# Altium project Power Board.PrjPcb
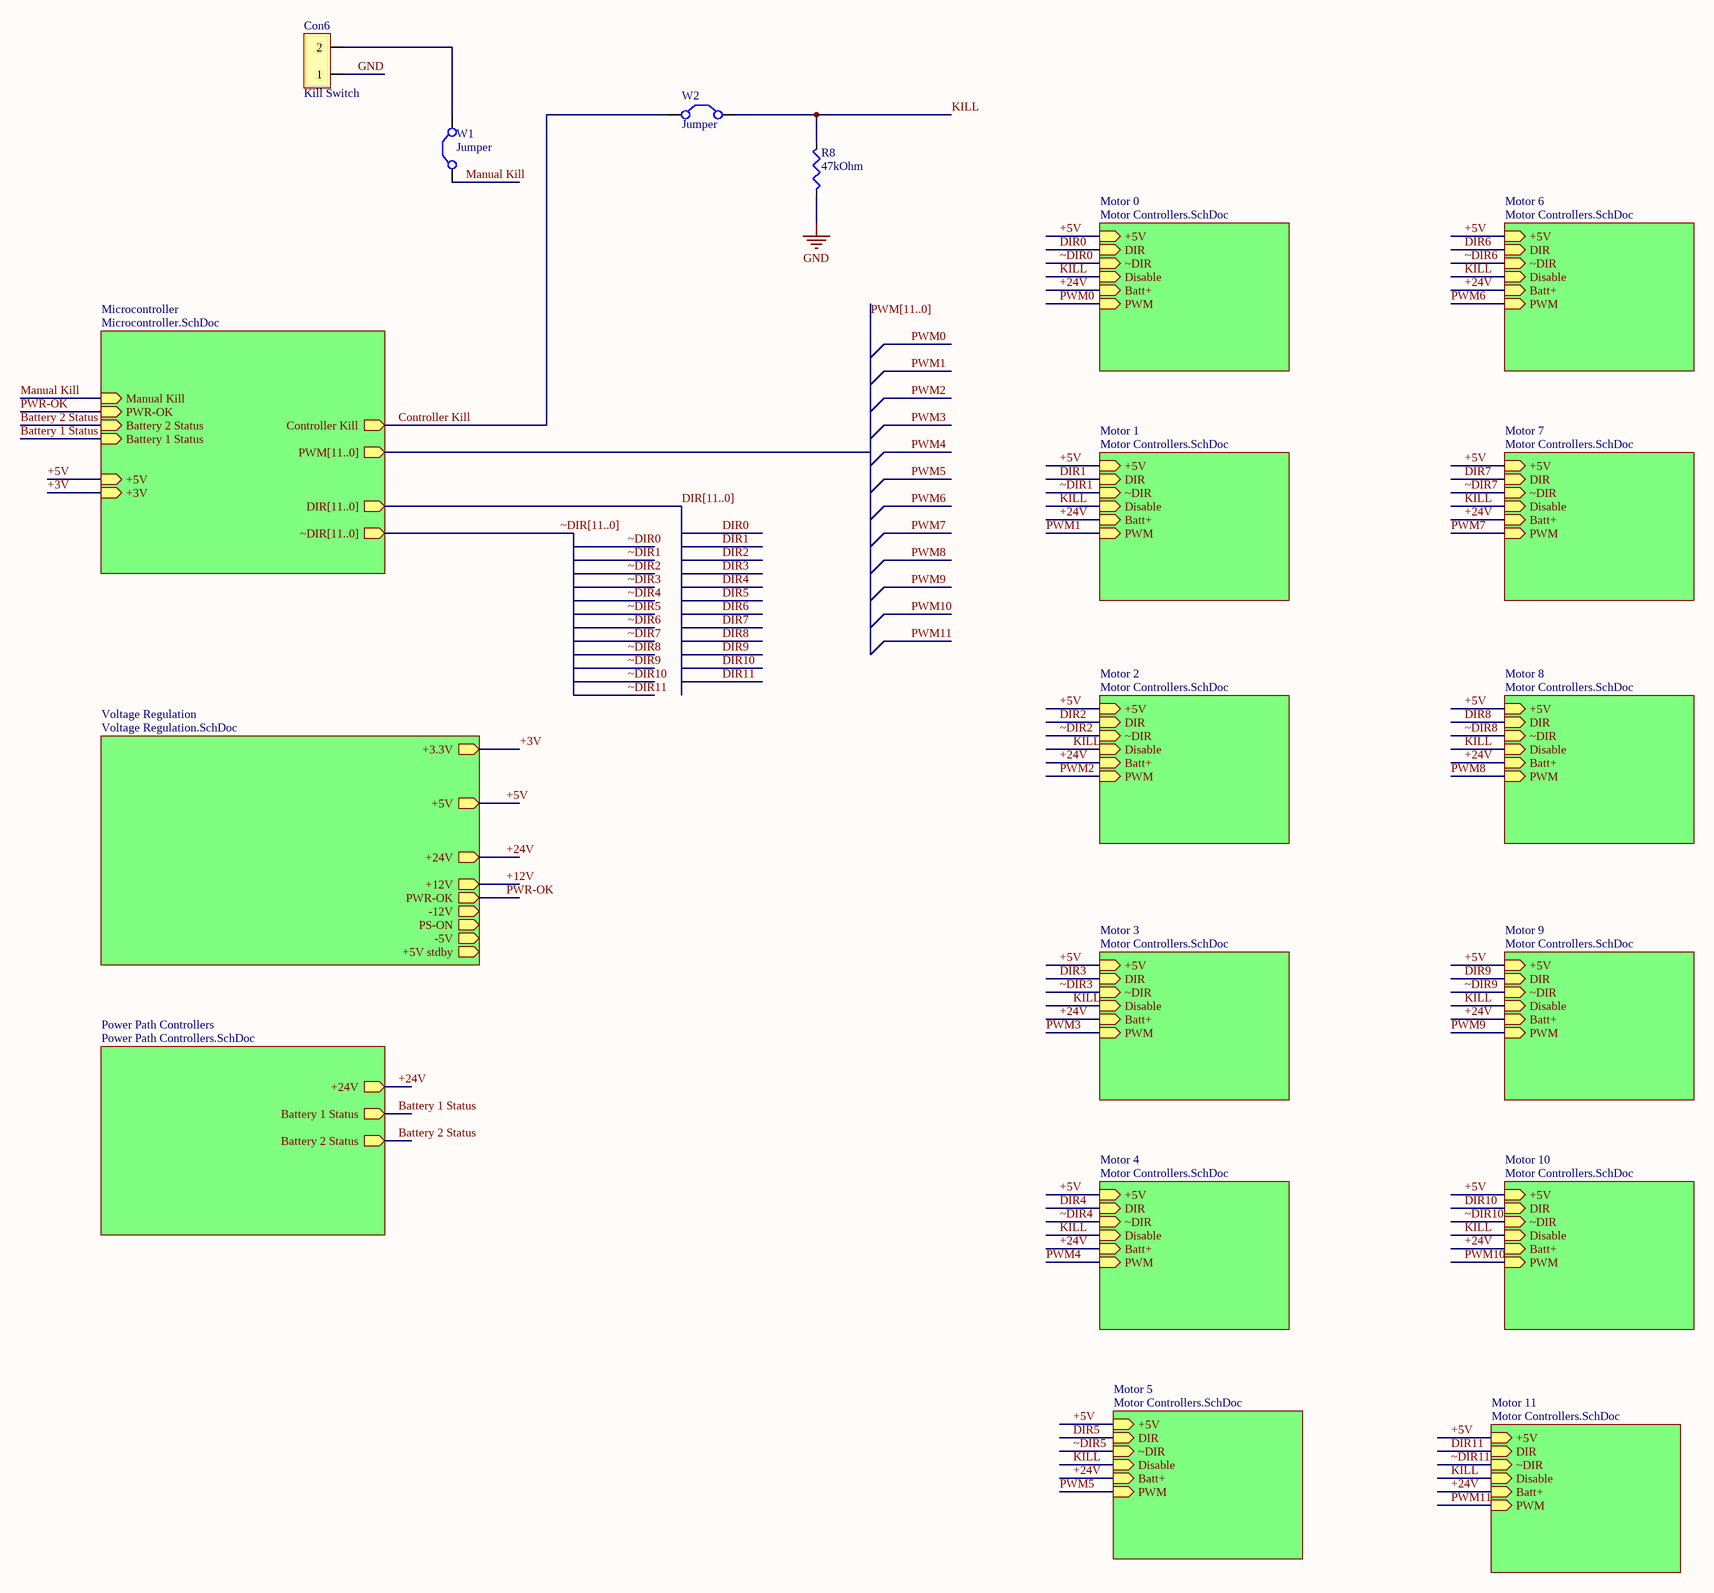
[diagram p0: Top Level Schematic.SchDoc]
3 sheets, 217 parts. Net scope: hierarchical (ports join the sheet entries above them; power ports are global).
Sheets:
  Top Level Schematic.SchDoc
    Microcontroller = Microcontroller.SchDoc
    Motor 0 = Motor Controllers.SchDoc
    Motor 1 = Motor Controllers.SchDoc
    Motor 2 = Motor Controllers.SchDoc
    Motor 3 = Motor Controllers.SchDoc
    Motor 4 = Motor Controllers.SchDoc
    Motor 5 = Motor Controllers.SchDoc
    Motor 6 = Motor Controllers.SchDoc
    Motor 7 = Motor Controllers.SchDoc
    Motor 8 = Motor Controllers.SchDoc
    Motor 9 = Motor Controllers.SchDoc
    Motor 11 = Motor Controllers.SchDoc
    Motor 10 = Motor Controllers.SchDoc

## Sheet Top Level Schematic.SchDoc
size E; DocumentNumber: 1; SheetNumber: 1; SheetTotal: 4

### Parts
Con6  Kill Switch  [5569 Mini-Fit Jr 2-Pos Right Angle w/ PCB Mounting Flange]
R8  47kOhm  [R 1210 (3225) RESISTOR]
W1  Jumper  [RAD-0.2]
W2  Jumper  [RAD-0.2]

### Sub-sheets
Microcontroller = Microcontroller.SchDoc: PWM[11..0] (out), DIR[11..0] (out), +5V (in), ~DIR[11..0] (out), +3V (in), Controller Kill (out), Battery 1 Status (in), Battery 2 Status (in), PWR-OK (in), Manual Kill (in)
Motor 0 = Motor Controllers.SchDoc: DIR (in), ~DIR (in), Disable (in), Batt+ (in), PWM (in), +5V (in)
Motor 1 = Motor Controllers.SchDoc: DIR (in), ~DIR (in), Disable (in), Batt+ (in), PWM (in), +5V (in)
Motor 2 = Motor Controllers.SchDoc: DIR (in), ~DIR (in), Disable (in), Batt+ (in), PWM (in), +5V (in)
Motor 3 = Motor Controllers.SchDoc: DIR (in), ~DIR (in), Disable (in), Batt+ (in), PWM (in), +5V (in)
Motor 4 = Motor Controllers.SchDoc: DIR (in), ~DIR (in), Disable (in), Batt+ (in), PWM (in), +5V (in)
Motor 5 = Motor Controllers.SchDoc: DIR (in), ~DIR (in), Disable (in), Batt+ (in), PWM (in), +5V (in)
Motor 6 = Motor Controllers.SchDoc: DIR (in), ~DIR (in), Disable (in), Batt+ (in), PWM (in), +5V (in)
Motor 7 = Motor Controllers.SchDoc: DIR (in), ~DIR (in), Disable (in), Batt+ (in), PWM (in), +5V (in)
Motor 8 = Motor Controllers.SchDoc: DIR (in), ~DIR (in), Disable (in), Batt+ (in), PWM (in), +5V (in)
Motor 9 = Motor Controllers.SchDoc: DIR (in), ~DIR (in), Disable (in), Batt+ (in), PWM (in), +5V (in)
Motor 10 = Motor Controllers.SchDoc: DIR (in), ~DIR (in), Disable (in), Batt+ (in), PWM (in), +5V (in)
Motor 11 = Motor Controllers.SchDoc: DIR (in), ~DIR (in), Disable (in), Batt+ (in), PWM (in), +5V (in)
Power Path Controllers = Power Path Controllers.SchDoc (file not in this document): +24V (out), Battery 1 Status (out), Battery 2 Status (out)
Voltage Regulation = Voltage Regulation.SchDoc (file not in this document): +3.3V (out), +5V (out), +12V (out), PWR-OK (out), -12V (out), PS-ON (out), -5V (out), +5V stdby (out), +24V (out)

### Nets
GND: Con6.1 R8.1
+3V: sheet Microcontroller/+3V, sheet Voltage Regulation/+3.3V
+5V: sheet Microcontroller/+5V, sheet Motor 0/+5V, sheet Motor 1/+5V, sheet Motor 2/+5V, sheet Motor 3/+5V, sheet Motor 4/+5V, sheet Motor 5/+5V, sheet Motor 6/+5V, sheet Motor 7/+5V, sheet Motor 8/+5V, sheet Motor 9/+5V, sheet Motor 11/+5V, sheet Motor 10/+5V, sheet Voltage Regulation/+5V
+12V: sheet Voltage Regulation/+12V
+24V: sheet Motor 0/Batt+, sheet Motor 1/Batt+, sheet Motor 2/Batt+, sheet Motor 3/Batt+, sheet Motor 4/Batt+, sheet Motor 5/Batt+, sheet Motor 6/Batt+, sheet Motor 7/Batt+, sheet Motor 8/Batt+, sheet Motor 9/Batt+, sheet Motor 11/Batt+, sheet Motor 10/Batt+, sheet Voltage Regulation/+24V, sheet Power Path Controllers/+24V
Battery 1 Status: sheet Microcontroller/Battery 1 Status, sheet Power Path Controllers/Battery 1 Status
Battery 2 Status: sheet Microcontroller/Battery 2 Status, sheet Power Path Controllers/Battery 2 Status
Controller Kill: W2.1(C1) ; sheet Microcontroller/Controller Kill
KILL: R8.2 W2.2(C2) ; sheet Motor 0/Disable, sheet Motor 1/Disable, sheet Motor 2/Disable, sheet Motor 3/Disable, sheet Motor 4/Disable, sheet Motor 5/Disable, sheet Motor 6/Disable, sheet Motor 7/Disable, sheet Motor 8/Disable, sheet Motor 9/Disable, sheet Motor 11/Disable, sheet Motor 10/Disable  [project net Disable]
Manual Kill: W1.1(C1) ; sheet Microcontroller/Manual Kill
PWR-OK: sheet Microcontroller/PWR-OK, sheet Voltage Regulation/PWR-OK
NetCon6_2: Con6.2 W1.2(C2)

### Buses and harness runs
bus DIR[11..0] = sheet Microcontroller/DIR[11..0]
bus PWM[11..0] = sheet Microcontroller/PWM[11..0]
bus ~DIR[11..0] = sheet Microcontroller/~DIR[11..0]

### Library data of the parts
Con6 = 5569 Mini-Fit Jr 2-Pos Right Angle
R8 = Resistor: Value: 0Ohm
W1 W2 = Jumper: Jumper Wire; Published: 24-Mar-1999; LatestRevisionDate: 17-Jul-2002; LatestRevisionNote: Re-released for DXP Platform.; PackageReference: RAD-0.2; Publisher: Altium Limited

## Sheet Microcontroller.SchDoc
size E; DocumentNumber: 2; SheetNumber: 2; SheetTotal: 4
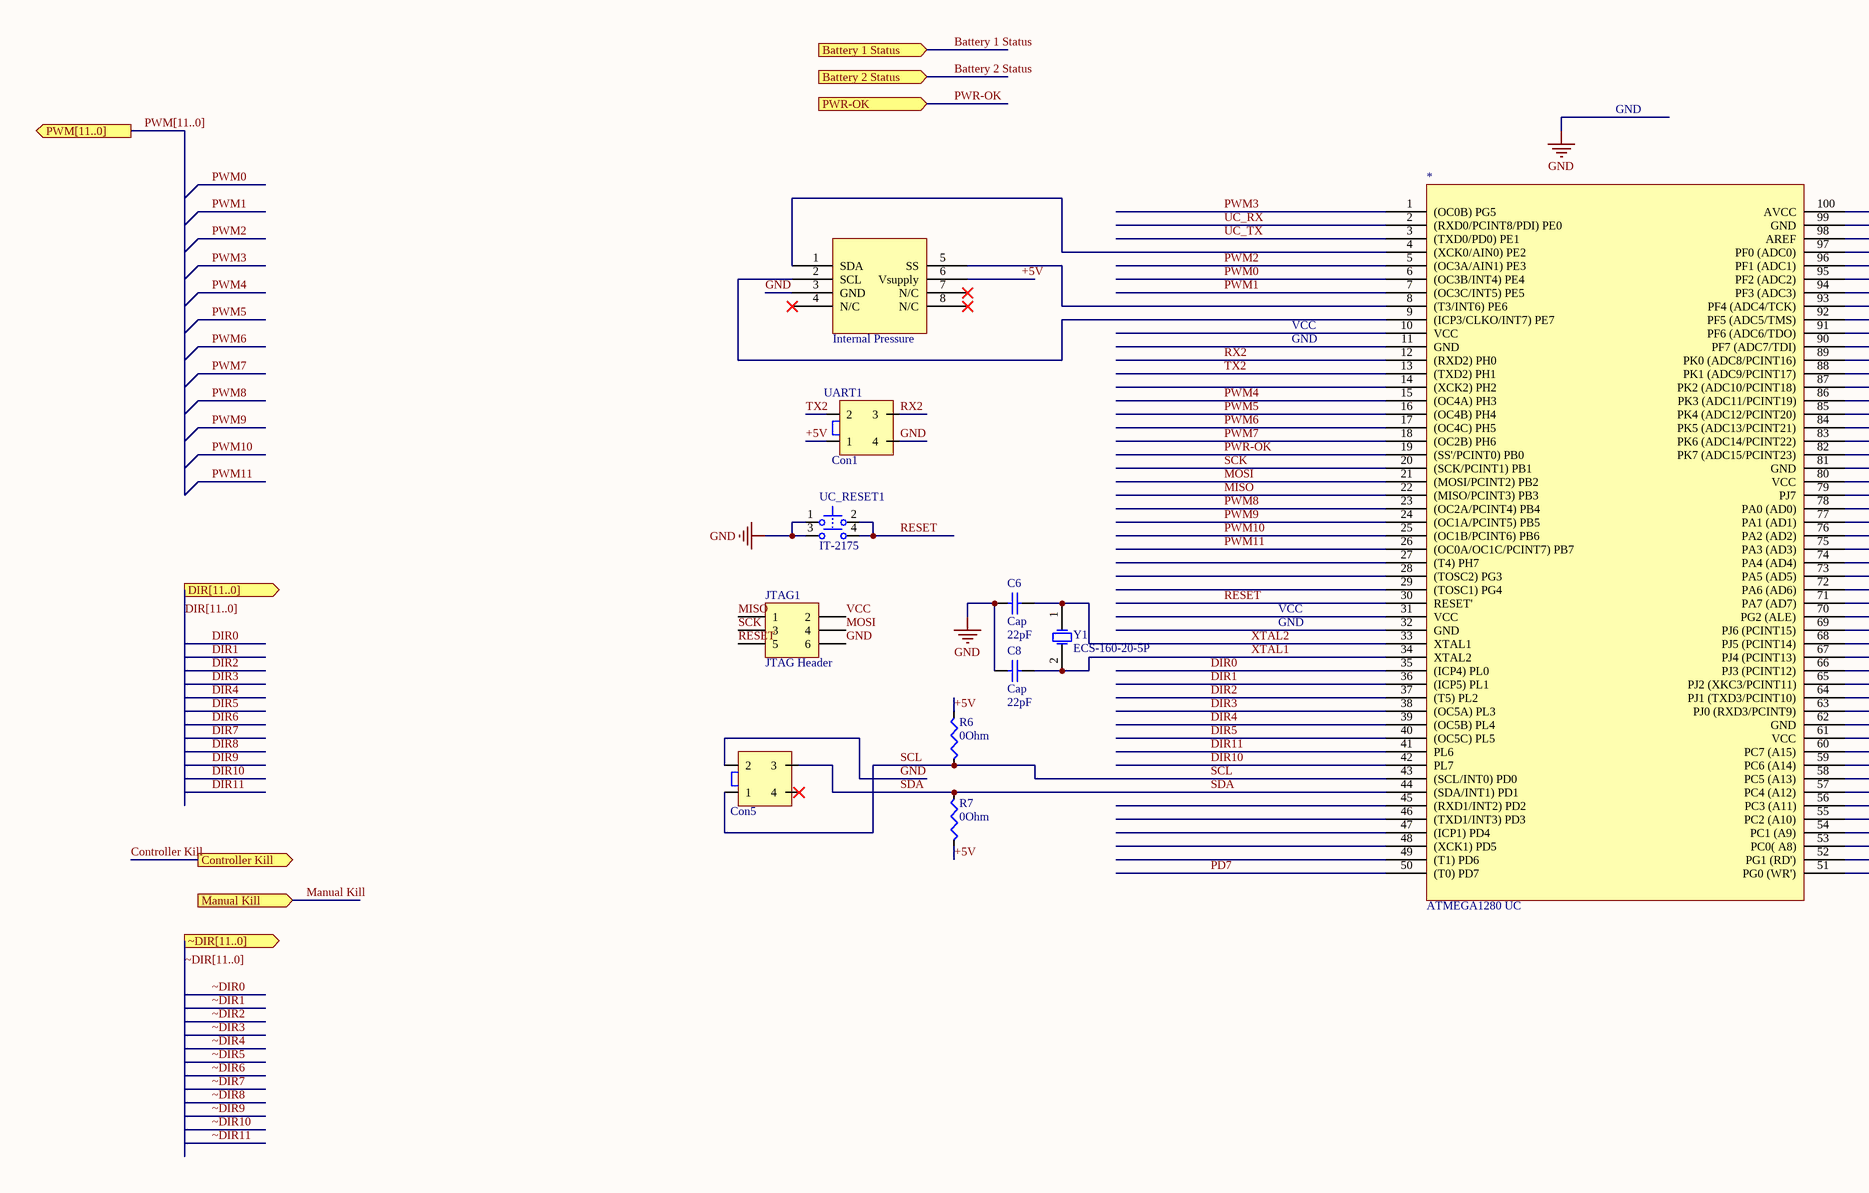
[diagram p1: Microcontroller.SchDoc, left]
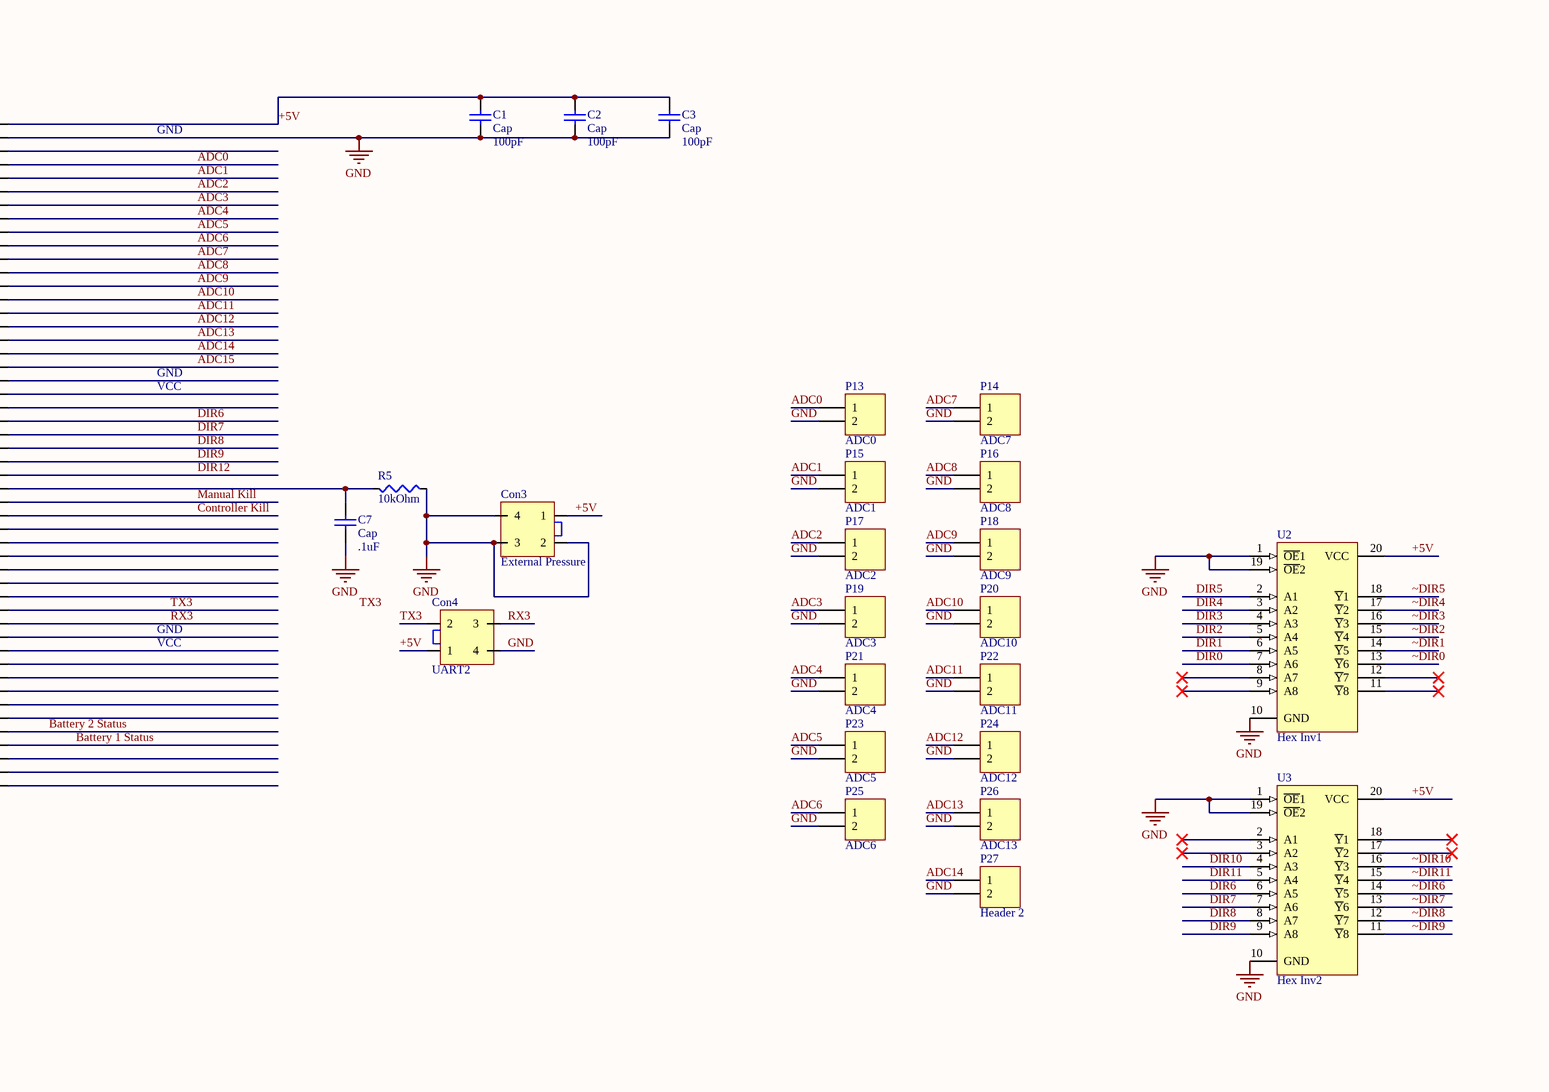
[diagram p2: Microcontroller.SchDoc, middle]
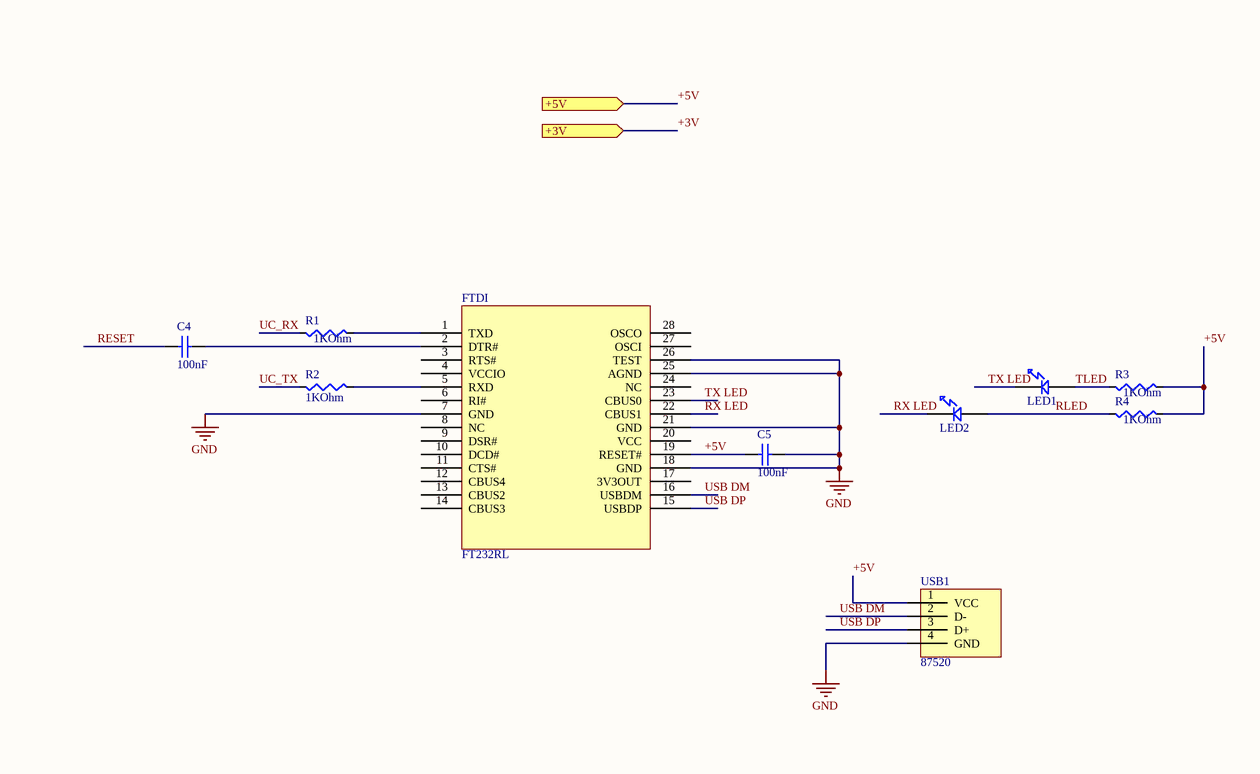
[diagram p3: Microcontroller.SchDoc, right]

### Parts
*  ATMEGA1280 UC  [TSQFP50P1600X1600X120-100N]
?  Internal Pressure  [SOP254P1740X1413-8N]
C1  Cap  value 100pF  [0805 (2012) Capacitor]
C2  Cap  value 100pF  [0805 (2012) Capacitor]
C3  Cap  value 100pF  [0805 (2012) Capacitor]
C4  100nF  [0805 (2012) Capacitor]
C5  100nF  [0805 (2012) Capacitor]
C6  Cap  value 22pF  [0805 (2012) Capacitor]
C7  Cap  value .1uF  [0805 (2012) Capacitor]
C8  Cap  value 22pF  [0805 (2012) Capacitor]
Con1  UART1  [5566-4]
Con3  External Pressure  [5566-4]
Con4  UART2  [5566-4]
Con5  5566-4  [5566-4]  (value not drawn)
FTDI  FT232RL  [SOP65P780X200-28N]
JTAG1  JTAG Header  [HDR2X3]
LED1  LED  [LED 0805]  (value not drawn)
LED2  LED  [LED 0805]  (value not drawn)
P13  ADC0  [HDR1X2]
P14  ADC7  [HDR1X2]
P15  ADC1  [HDR1X2]
P16  ADC8  [HDR1X2]
P17  ADC2  [HDR1X2]
P18  ADC9  [HDR1X2]
P19  ADC3  [HDR1X2]
P20  ADC10  [HDR1X2]
P21  ADC4  [HDR1X2]
P22  ADC11  [HDR1X2]
P23  ADC5  [HDR1X2]
P24  ADC12  [HDR1X2]
P25  ADC6  [HDR1X2]
P26  ADC13  [HDR1X2]
P27  Header 2  [HDR1X2]
R1  1KOhm  [R 0805 (2012) RESISTOR]
R2  1KOhm  [R 0805 (2012) RESISTOR]
R3  1KOhm  [R 0805 (2012) RESISTOR]
R4  1KOhm  [R 0805 (2012) RESISTOR]
R5  10kOhm  [R 0805 (2012) RESISTOR]
R6  0Ohm  [R 1210 (3225) RESISTOR]
R7  0Ohm  [R 1210 (3225) RESISTOR]
U2  Hex Inv1  [DW020_N]
U3  Hex Inv2  [DW020_N]
UC_RESET1  IT-2175  [IT-2175]
USB1  87520  [87520-0010BLF]
Y1  ECS-160-20-5P  [CSM-7]

### Ports
+3V (in), +5V (in), Battery 1 Status (in), Battery 2 Status (in), Controller Kill (out), DIR[11..0] (out), Manual Kill (in), PWM[11..0] (out), PWR-OK (in), ~DIR[11..0] (out)

### Nets
GND: *.11(GND) *.32(GND) *.62(GND) *.81(GND) *.99(GND) ?.3(GND) C1.1 C2.1 C3.1 C5.2 C6.1 C7.2 C8.1 Con1.4 Con3.2 Con3.3 Con3.4 Con4.4 Con5.2 FTDI.7(GND) FTDI.18(GND) FTDI.21(GND) FTDI.25(AGND) FTDI.26(TEST) JTAG1.6 P13.2 P14.2 P15.2 P16.2 P17.2 P18.2 P19.2 P20.2 P21.2 P22.2 P23.2 P24.2 P25.2 P26.2 P27.2 R5.2 U2.1(~{OE}1) U2.10(GND) U2.19(~{OE}2) U3.1(~{OE}1) U3.10(GND) U3.19(~{OE}2) UC_RESET1.1 UC_RESET1.3 USB1.4(GND)
+3V: port +3V
+5V: *.100(AVCC) ?.6(Vsupply) C1.2 C2.2 C3.2 C5.1 Con1.1 Con3.1 Con4.1 FTDI.19(RESET#) R3.2 R4.2 R6.2 R7.1 U2.20(VCC) U3.20(VCC) USB1.1(VCC) ; port +5V
ADC0: *.97(PF0_(ADC0)) P13.1
ADC1: *.96(PF1_(ADC1)) P15.1
ADC2: *.95(PF2_(ADC2)) P17.1
ADC3: *.94(PF3_(ADC3)) P19.1
ADC4: *.93(PF4_(ADC4/TCK)) P21.1
ADC5: *.92(PF5_(ADC5/TMS)) P23.1
ADC6: *.91(PF6_(ADC6/TDO)) P25.1
ADC7: *.90(PF7_(ADC7/TDI)) P14.1
ADC8: *.89(PK0_(ADC8/PCINT16)) P16.1
ADC9: *.88(PK1_(ADC9/PCINT17)) P18.1
ADC10: *.87(PK2_(ADC10/PCINT18)) P20.1
ADC11: *.86(PK3_(ADC11/PCINT19)) P22.1
ADC12: *.85(PK4_(ADC12/PCINT20)) P24.1
ADC13: *.84(PK5_(ADC13/PCINT21)) P26.1
ADC14: *.83(PK6_(ADC14/PCINT22)) P27.1
ADC15: *.82(PK7_(ADC15/PCINT23))
Battery 1 Status: *.54(PC1_(A9)) ; port Battery 1 Status
Battery 2 Status: *.55(PC2_(A10)) ; port Battery 2 Status
Controller Kill: *.71(PA7_(AD7)) ; port Controller Kill
DIR0: *.35((ICP4)_PL0) U2.7(A6)  [project net DIR]
DIR1: *.36((ICP5)_PL1) U2.6(A5)  [project net DIR]
DIR2: *.37((T5)_PL2) U2.5(A4)  [project net DIR]
DIR3: *.38((OC5A)_PL3) U2.4(A3)  [project net DIR]
DIR4: *.39((OC5B)_PL4) U2.3(A2)  [project net DIR]
DIR5: *.40((OC5C)_PL5) U2.2(A1)  [project net DIR]
DIR6: *.78(PA0_(AD0)) U3.6(A5)  [project net DIR]
DIR7: *.77(PA1_(AD1)) U3.7(A6)  [project net DIR]
DIR8: *.76(PA2_(AD2)) U3.8(A7)  [project net DIR]
DIR9: *.75(PA3_(AD3)) U3.9(A8)  [project net DIR]
DIR10: *.42(PL7) U3.4(A3)  [project net DIR]
DIR11: *.41(PL6) U3.5(A4)  [project net DIR]
DIR12: *.74(PA4_(AD4))
Manual Kill: *.72(PA6_(AD6)) ; port Manual Kill
MISO: *.22((MISO/PCINT3)_PB3) JTAG1.1
MOSI: *.21((MOSI/PCINT2)_PB2) JTAG1.4
PD7: *.50((T0)_PD7)
PWM0: *.6((OC3B/INT4)_PE4)  [project net PWM]
PWM1: *.7((OC3C/INT5)_PE5)  [project net PWM]
PWM2: *.5((OC3A/AIN1)_PE3)  [project net PWM]
PWM3: *.1((OC0B)_PG5)  [project net PWM]
PWM4: *.15((OC4A)_PH3)  [project net PWM]
PWM5: *.16((OC4B)_PH4)  [project net PWM]
PWM6: *.17((OC4C)_PH5)  [project net PWM]
PWM7: *.18((OC2B)_PH6)  [project net PWM]
PWM8: *.23((OC2A/PCINT4)_PB4)  [project net PWM]
PWM9: *.24((OC1A/PCINT5)_PB5)  [project net PWM]
PWM10: *.25((OC1B/PCINT6)_PB6)  [project net PWM]
PWM11: *.26((OC0A/OC1C/PCINT7)_PB7)  [project net PWM]
PWR-OK: *.19((SS'/PCINT0)_PB0) ; port PWR-OK
RESET: *.30(RESET') C4.1 JTAG1.5 UC_RESET1.2 UC_RESET1.4
RLED: LED2.2 R4.1
RX2: *.12((RXD2)_PH0) Con1.3
RX3: *.63(PJ0_(RXD3/PCINT9)) Con4.3
RX LED: FTDI.22(CBUS1) LED2.1
SCK: *.20((SCK/PCINT1)_PB1) JTAG1.3
SCL: *.43((SCL/INT0)_PD0) Con5.1 R6.1
SDA: *.44((SDA/INT1)_PD1) Con5.3 R7.2
TLED: LED1.2 R3.1
TX2: *.13((TXD2)_PH1) Con1.2
TX3: *.64(PJ1_(TXD3/PCINT10)) Con4.2
TX LED: FTDI.23(CBUS0) LED1.1
UC_RX: *.2((RXD0/PCINT8/PDI)_PE0) R1.1
UC_TX: *.3((TXD0/PD0)_PE1) R2.1
USB DM: FTDI.16(USBDM) USB1.2(D-)
USB DP: FTDI.15(USBDP) USB1.3(D+)
VCC: *.10(VCC) *.31(VCC) *.61(VCC) *.80(VCC) JTAG1.2
XTAL1: *.34(XTAL2) C8.2 Y1.2(OSC2)
XTAL2: *.33(XTAL1) C6.2 Y1.1(OSC1)
~DIR0: U2.13(~{Y}6)  [project net ~DIR]
~DIR1: U2.14(~{Y}5)  [project net ~DIR]
~DIR2: U2.15(~{Y}4)  [project net ~DIR]
~DIR3: U2.16(~{Y}3)  [project net ~DIR]
~DIR4: U2.17(~{Y}2)  [project net ~DIR]
~DIR5: U2.18(~{Y}1)  [project net ~DIR]
~DIR6: U3.14(~{Y}5)  [project net ~DIR]
~DIR7: U3.13(~{Y}6)  [project net ~DIR]
~DIR8: U3.12(~{Y}7)  [project net ~DIR]
~DIR9: U3.11(~{Y}8)  [project net ~DIR]
~DIR10: U3.16(~{Y}3)  [project net ~DIR]
~DIR11: U3.15(~{Y}4)  [project net ~DIR]
Net*_4: *.4((XCK0/AIN0)_PE2) ?.1(SDA)
Net*_8: *.8((T3/INT6)_PE6) ?.5(SS)
Net*_9: *.9((ICP3/CLKO/INT7)_PE7) ?.2(SCL)
Net*_73: *.73(PA5_(AD5)) C7.1 R5.1
NetC4_2: C4.2 FTDI.2(DTR#)
NetFTDI_1: FTDI.1(TXD) R1.2
NetFTDI_5: FTDI.5(RXD) R2.2

Not connected (* = marked no-connect by the designer): * 14((XCK2)_PH2) 27((T4)_PH7) 28((TOSC2)_PG3) 29((TOSC1)_PG4) 45((RXD1/INT2)_PD2) 46((TXD1/INT3)_PD3) 47((ICP1)_PD4) 48((XCK1)_PD5) 49((T1)_PD6) 51(PG0_(WR')) 52(PG1_(RD')) 53(PC0(_A8)) 56(PC3_(A11)) 57(PC4_(A12)) 58(PC5_(A13)) 59(PC6_(A14)) 60(PC7_(A15)) 65(PJ2_(XKC3/PCINT11)) 66(PJ3_(PCINT12)) 67(PJ4_(PCINT13)) 68(PJ5_(PCINT14)) 69(PJ6_(PCINT15)) 70(PG2_(ALE)) 79(PJ7) 98(AREF); ? 4(N/C)* 7(N/C)* 8(N/C)*; Con5 4*; FTDI 3(RTS#) 4(VCCIO) 6(RI#) 8(NC) 9(DSR#) 10(DCD#) 11(CTS#) 12(CBUS4) 13(CBUS2) 14(CBUS3) 17(3V3OUT) 20(VCC) 24(NC) 27(OSCI) 28(OSCO); U2 8(A7)* 9(A8)* 11(~{Y}8)* 12(~{Y}7)*; U3 2(A1)* 3(A2)* 17(~{Y}2)* 18(~{Y}1)*

### Buses and harness runs
bus DIR[11..0] = port DIR[11..0]
bus PWM[11..0] = port PWM[11..0]
bus ~DIR[11..0] = port ~DIR[11..0]

### Notes on the sheet
- Labels drawn without touching a wire or pin: TX3

### Library data of the parts
* ? FTDI = Component_1
C1-C3 C6-C8 = Cap: Capacitor; Published: 8-Jun-2000; LatestRevisionDate: 17-Jul-2002; LatestRevisionNote: Re-released for DXP Platform.; PackageReference: RAD-0.3; Publisher: Altium Limited
C4 C5 = Capacitor (non-polarized): Capacitor; Value: .1uF
Con1 Con3-Con5 = 5566-4: 4.20mm (.165") Pitch Mini-Fit Jr.™ Header, Dual Row, Vertical, without Snap-in Plastic Peg PCB Lock, 4 Circuits, PA Polyamide Nylon 6/6 94V-2, Tin (Sn) Plating, without Drain Holes
JTAG1 = Header 3X2: Header, 3-Pin, Dual row; LatestRevisionDate: 17-Jul-2002; LatestRevisionNote: Re-released for DXP Platform.; Publisher: Altium Limited
LED1 LED2 = LED: Standard LED
P13-P27 = Header 2: Header, 2-Pin; LatestRevisionDate: 17-Jul-2002; LatestRevisionNote: Re-released for DXP Platform.; Publisher: Altium Limited
R1-R5 = Resistor: Value: 0Ohm
R6 R7 = Resistor: Value: 0Ohm
U2 U3 = SN74HCT540DW: Octal Buffer and Line Driver with 3-State Outputs; Published: 8-Jun-2000; LatestRevisionDate: 13-Apr-2006; LatestRevisionNote: IPC-7351 Footprint Added.; DatasheetVersion: May-1997; PackageVersion: Mar-2000; PackageReference: DW020; Publisher: Altium Limited; PackageDescription: 20-Pin Plastic Small Outline Integrated Circuit 1.27 mm Pitch; Code_JEDEC: MS-013; Code_IPC: SOIC127P1030-20; ComponentLink1Description: Manufacturer Link; ComponentLink1URL: http://www.ti.com/; ComponentLink2Description: Datasheet; ComponentLink2URL: http://www-s.ti.com/sc/ds/sn74hct540.pdf
UC_RESET1 = IT-2175: Tactile Switch, DPST; Thru-Hole; Vertical; Rating DC 12V, 50mA (max); PackageDocument: Rev.0; Published: 6-Jun-2005; DatasheetDocument: Rev.0; PackageReference: IT-2175; Publisher: Altium Limited; ComponentLink1Description: Manufacturer Link; ComponentLink1URL: http://www.ilswitch.com/; ComponentLink2Description: Device Overview; ComponentLink2URL: http://www.ilswitch.com/list.php?ac_id=010112&ai_id=91
USB1 = 87520: 87520 USB Through Hole Type A Right Angle Receptacle
Y1 = ECS-120-32-1: Crystal Oscillator; Published: 17-Jul-2002; DatasheetDocument: 18-Apr-2000; PackageReference: HC-49U; Publisher: Altium Limited; ComponentLink1Description: Manufacturer Link; ComponentLink1URL: http://www.ecsxtal.com/; ComponentLink2Description: Datasheet; ComponentLink2URL: http://www.ecsxtal.com/pdf2/HC49U.PDF

## Sheet Motor Controllers.SchDoc
size B; DocumentNumber: 3; SheetNumber: 3; SheetTotal: 4
Used 12 times, as channels Motor 0, Motor 1, Motor 2, Motor 3, Motor 4, Motor 5, Motor 6, Motor 7, Motor 8, Motor 9, Motor 11, Motor 10. Parts and nets are listed once, with the designators drawn on the sheet.
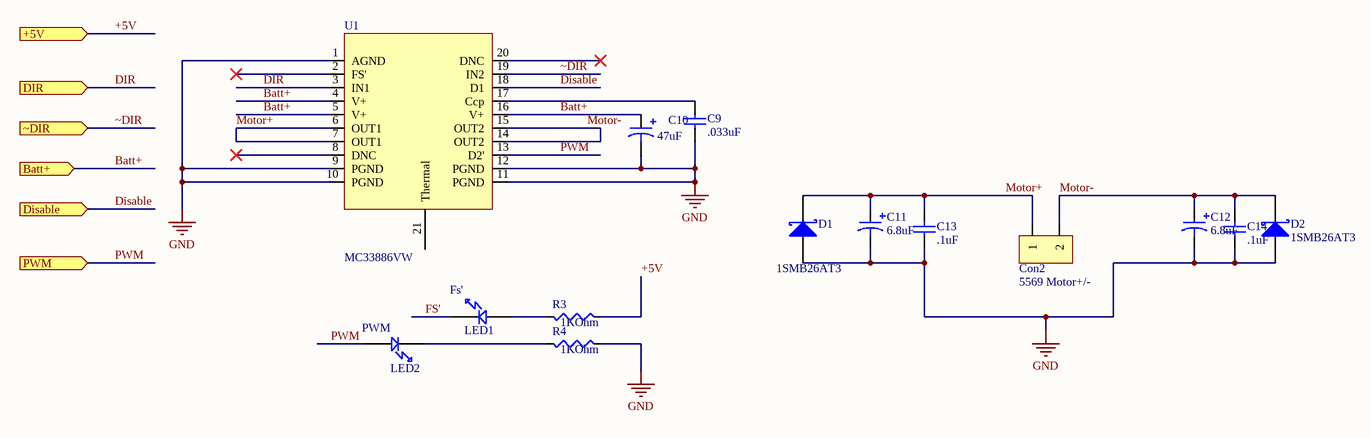
[diagram p4: Motor Controllers.SchDoc]

### Parts
C9  .033uF  [0805 (2012) Capacitor]
C10  47uF  [Radial_6.3mmDia_SM_D]
C11  6.8uF  [Radial_8mmDia_SM_E]
C12  6.8uF  [Radial_8mmDia_SM_E]
C13  .1uF  [0805 (2012) Capacitor]
C14  .1uF  [0805 (2012) Capacitor]
Con2  5569 Motor+/-  [5569 Mini-Fit Jr 2-Pos Right Angle w/ PCB Mounting Flange]
D1  1SMB26AT3  [SMB]
D2  1SMB26AT3  [SMB]
LED1  Fs'  [LED 0805]
LED2  PWM  [LED 0805]
R3  1KOhm  [R 0805 (2012) RESISTOR]
R4  1KOhm  [R 0805 (2012) RESISTOR]
U1  MC33886VW  [SOP127P1420X340_HS-20N]

### Ports
+5V (in), Batt+ (in), DIR (in), Disable (in), PWM (in), ~DIR (in)

### Nets
GND: C9.1 C10.N C11.N C12.N C13.1 C14.1 D1.1(A) D2.1(A) R4.2 U1.1(AGND) U1.9(PGND) U1.10(PGND) U1.11(PGND) U1.12(PGND)
+5V: R3.2 ; port +5V
Batt+: C10.P U1.4(V+) U1.5(V+) U1.16(V+) ; port Batt+
DIR: U1.3(IN1) ; port DIR
Disable: U1.18(D1) ; port Disable
FS': LED1.1
Motor+: C11.P C13.2 Con2.1 D1.2(K) U1.6(OUT1) U1.7(OUT1)
Motor-: C12.P C14.2 Con2.2 D2.2(K) U1.14(OUT2) U1.15(OUT2)
PWM: LED2.2 U1.13(D2') ; port PWM
~DIR: U1.19(IN2) ; port ~DIR
NetC9_2: C9.2 U1.17(Ccp)
NetLED1_2: LED1.2 R3.1
NetLED2_1: LED2.1 R4.1

Not connected (* = marked no-connect by the designer): U1 2(FS')* 8(DNC)* 20(DNC)* 21(Thermal)

### Channels
Motor 0: designators end in _Motor_0; ports +5V=+5V Batt+=+24V DIR=DIR Disable=Disable PWM=PWM ~DIR=~DIR
Motor 1: designators end in _Motor_1; ports +5V=+5V Batt+=+24V DIR=DIR Disable=Disable PWM=PWM ~DIR=~DIR
Motor 2: designators end in _Motor_2; ports +5V=+5V Batt+=+24V DIR=DIR Disable=Disable PWM=PWM ~DIR=~DIR
Motor 3: designators end in _Motor_3; ports +5V=+5V Batt+=+24V DIR=DIR Disable=Disable PWM=PWM ~DIR=~DIR
Motor 4: designators end in _Motor_4; ports +5V=+5V Batt+=+24V DIR=DIR Disable=Disable PWM=PWM ~DIR=~DIR
Motor 5: designators end in _Motor_5; ports +5V=+5V Batt+=+24V DIR=DIR Disable=Disable PWM=PWM ~DIR=~DIR
Motor 6: designators end in _Motor_6; ports +5V=+5V Batt+=+24V DIR=DIR Disable=Disable PWM=PWM ~DIR=~DIR
Motor 7: designators end in _Motor_7; ports +5V=+5V Batt+=+24V DIR=DIR Disable=Disable PWM=PWM ~DIR=~DIR
Motor 8: designators end in _Motor_8; ports +5V=+5V Batt+=+24V DIR=DIR Disable=Disable PWM=PWM ~DIR=~DIR
Motor 9: designators end in _Motor_9; ports +5V=+5V Batt+=+24V DIR=DIR Disable=Disable PWM=PWM ~DIR=~DIR
Motor 11: designators end in _Motor_11; ports +5V=+5V Batt+=+24V DIR=DIR Disable=Disable PWM=PWM ~DIR=~DIR
Motor 10: designators end in _Motor_10; ports +5V=+5V Batt+=+24V DIR=DIR Disable=Disable PWM=PWM ~DIR=~DIR

### Library data of the parts
C9 = Capacitor (non-polarized): Capacitor; Value: .1uF
C10-C12 = Capacitor (polarized)
C13 C14 = Capacitor (non-polarized): Capacitor; Value: .1uF
Con2 = 5569 Mini-Fit Jr 2-Pos Right Angle
D1 D2 = D Schottky: Schottky Diode; Published: 8-Jun-2000; LatestRevisionDate: 17-Jul-2002; LatestRevisionNote: Re-released for DXP Platform.; PackageReference: SMB; Publisher: Altium Limited; Code_JEDEC: DO-214-AA
LED1 LED2 = LED: Standard LED
R3 R4 = Resistor: Value: 0Ohm
U1 = MC33886VW: Motor Controller

## Nets that join several sheets
GND: Top Level Schematic (Con6.1 R8.1), Microcontroller (50 pins), Motor 0 (14 pins), Motor 1 (14 pins), Motor 2 (14 pins), Motor 3 (14 pins), Motor 4 (14 pins), Motor 5 (14 pins), Motor 6 (14 pins), Motor 7 (14 pins), Motor 8 (14 pins), Motor 9 (14 pins), Motor 11 (14 pins), Motor 10 (14 pins)
+5V: Microcontroller (17 pins), Motor 0 (R3_Motor_0.2), Motor 1 (R3_Motor_1.2), Motor 2 (R3_Motor_2.2), Motor 3 (R3_Motor_3.2), Motor 4 (R3_Motor_4.2), Motor 5 (R3_Motor_5.2), Motor 6 (R3_Motor_6.2), Motor 7 (R3_Motor_7.2), Motor 8 (R3_Motor_8.2), Motor 9 (R3_Motor_9.2), Motor 11 (R3_Motor_11.2), Motor 10 (R3_Motor_10.2)
+24V: Motor 0 (C10_Motor_0.P U1_Motor_0.4 U1_Motor_0.5 U1_Motor_0.16), Motor 1 (C10_Motor_1.P U1_Motor_1.4 U1_Motor_1.5 U1_Motor_1.16), Motor 2 (C10_Motor_2.P U1_Motor_2.4 U1_Motor_2.5 U1_Motor_2.16), Motor 3 (C10_Motor_3.P U1_Motor_3.4 U1_Motor_3.5 U1_Motor_3.16), Motor 4 (C10_Motor_4.P U1_Motor_4.4 U1_Motor_4.5 U1_Motor_4.16), Motor 5 (C10_Motor_5.P U1_Motor_5.4 U1_Motor_5.5 U1_Motor_5.16), Motor 6 (C10_Motor_6.P U1_Motor_6.4 U1_Motor_6.5 U1_Motor_6.16), Motor 7 (C10_Motor_7.P U1_Motor_7.4 U1_Motor_7.5 U1_Motor_7.16), Motor 8 (C10_Motor_8.P U1_Motor_8.4 U1_Motor_8.5 U1_Motor_8.16), Motor 9 (C10_Motor_9.P U1_Motor_9.4 U1_Motor_9.5 U1_Motor_9.16), Motor 11 (C10_Motor_11.P U1_Motor_11.4 U1_Motor_11.5 U1_Motor_11.16), Motor 10 (C10_Motor_10.P U1_Motor_10.4 U1_Motor_10.5 U1_Motor_10.16)
Controller Kill: Top Level Schematic (W2.1), Microcontroller (*.71)
DIR: Microcontroller (*.40 U2.2), Motor 5 (U1_Motor_5.3)
DIR: Microcontroller (*.39 U2.3), Motor 4 (U1_Motor_4.3)
DIR: Microcontroller (*.38 U2.4), Motor 3 (U1_Motor_3.3)
DIR: Microcontroller (*.37 U2.5), Motor 2 (U1_Motor_2.3)
DIR: Microcontroller (*.36 U2.6), Motor 1 (U1_Motor_1.3)
DIR: Microcontroller (*.35 U2.7), Motor 0 (U1_Motor_0.3)
DIR: Microcontroller (*.42 U3.4), Motor 10 (U1_Motor_10.3)
DIR: Microcontroller (*.41 U3.5), Motor 11 (U1_Motor_11.3)
DIR: Microcontroller (*.78 U3.6), Motor 6 (U1_Motor_6.3)
DIR: Microcontroller (*.77 U3.7), Motor 7 (U1_Motor_7.3)
DIR: Microcontroller (*.76 U3.8), Motor 8 (U1_Motor_8.3)
DIR: Microcontroller (*.75 U3.9), Motor 9 (U1_Motor_9.3)
Disable: Top Level Schematic (R8.2 W2.2), Motor 0 (U1_Motor_0.18), Motor 1 (U1_Motor_1.18), Motor 2 (U1_Motor_2.18), Motor 3 (U1_Motor_3.18), Motor 4 (U1_Motor_4.18), Motor 5 (U1_Motor_5.18), Motor 6 (U1_Motor_6.18), Motor 7 (U1_Motor_7.18), Motor 8 (U1_Motor_8.18), Motor 9 (U1_Motor_9.18), Motor 11 (U1_Motor_11.18), Motor 10 (U1_Motor_10.18)
Manual Kill: Top Level Schematic (W1.1), Microcontroller (*.72)
PWM: Microcontroller (*.1), Motor 3 (LED2_Motor_3.2 U1_Motor_3.13)
PWM: Microcontroller (*.5), Motor 2 (LED2_Motor_2.2 U1_Motor_2.13)
PWM: Microcontroller (*.6), Motor 0 (LED2_Motor_0.2 U1_Motor_0.13)
PWM: Microcontroller (*.7), Motor 1 (LED2_Motor_1.2 U1_Motor_1.13)
PWM: Microcontroller (*.15), Motor 4 (LED2_Motor_4.2 U1_Motor_4.13)
PWM: Microcontroller (*.16), Motor 5 (LED2_Motor_5.2 U1_Motor_5.13)
PWM: Microcontroller (*.17), Motor 6 (LED2_Motor_6.2 U1_Motor_6.13)
PWM: Microcontroller (*.18), Motor 7 (LED2_Motor_7.2 U1_Motor_7.13)
PWM: Microcontroller (*.23), Motor 8 (LED2_Motor_8.2 U1_Motor_8.13)
PWM: Microcontroller (*.24), Motor 9 (LED2_Motor_9.2 U1_Motor_9.13)
PWM: Microcontroller (*.25), Motor 10 (LED2_Motor_10.2 U1_Motor_10.13)
PWM: Microcontroller (*.26), Motor 11 (LED2_Motor_11.2 U1_Motor_11.13)
~DIR: Microcontroller (U2.13), Motor 0 (U1_Motor_0.19)
~DIR: Microcontroller (U2.14), Motor 1 (U1_Motor_1.19)
~DIR: Microcontroller (U2.15), Motor 2 (U1_Motor_2.19)
~DIR: Microcontroller (U2.16), Motor 3 (U1_Motor_3.19)
~DIR: Microcontroller (U2.17), Motor 4 (U1_Motor_4.19)
~DIR: Microcontroller (U2.18), Motor 5 (U1_Motor_5.19)
~DIR: Microcontroller (U3.11), Motor 9 (U1_Motor_9.19)
~DIR: Microcontroller (U3.12), Motor 8 (U1_Motor_8.19)
~DIR: Microcontroller (U3.13), Motor 7 (U1_Motor_7.19)
~DIR: Microcontroller (U3.14), Motor 6 (U1_Motor_6.19)
~DIR: Microcontroller (U3.15), Motor 11 (U1_Motor_11.19)
~DIR: Microcontroller (U3.16), Motor 10 (U1_Motor_10.19)